# Altium schematic sheet Schematic.SchDoc
size A4
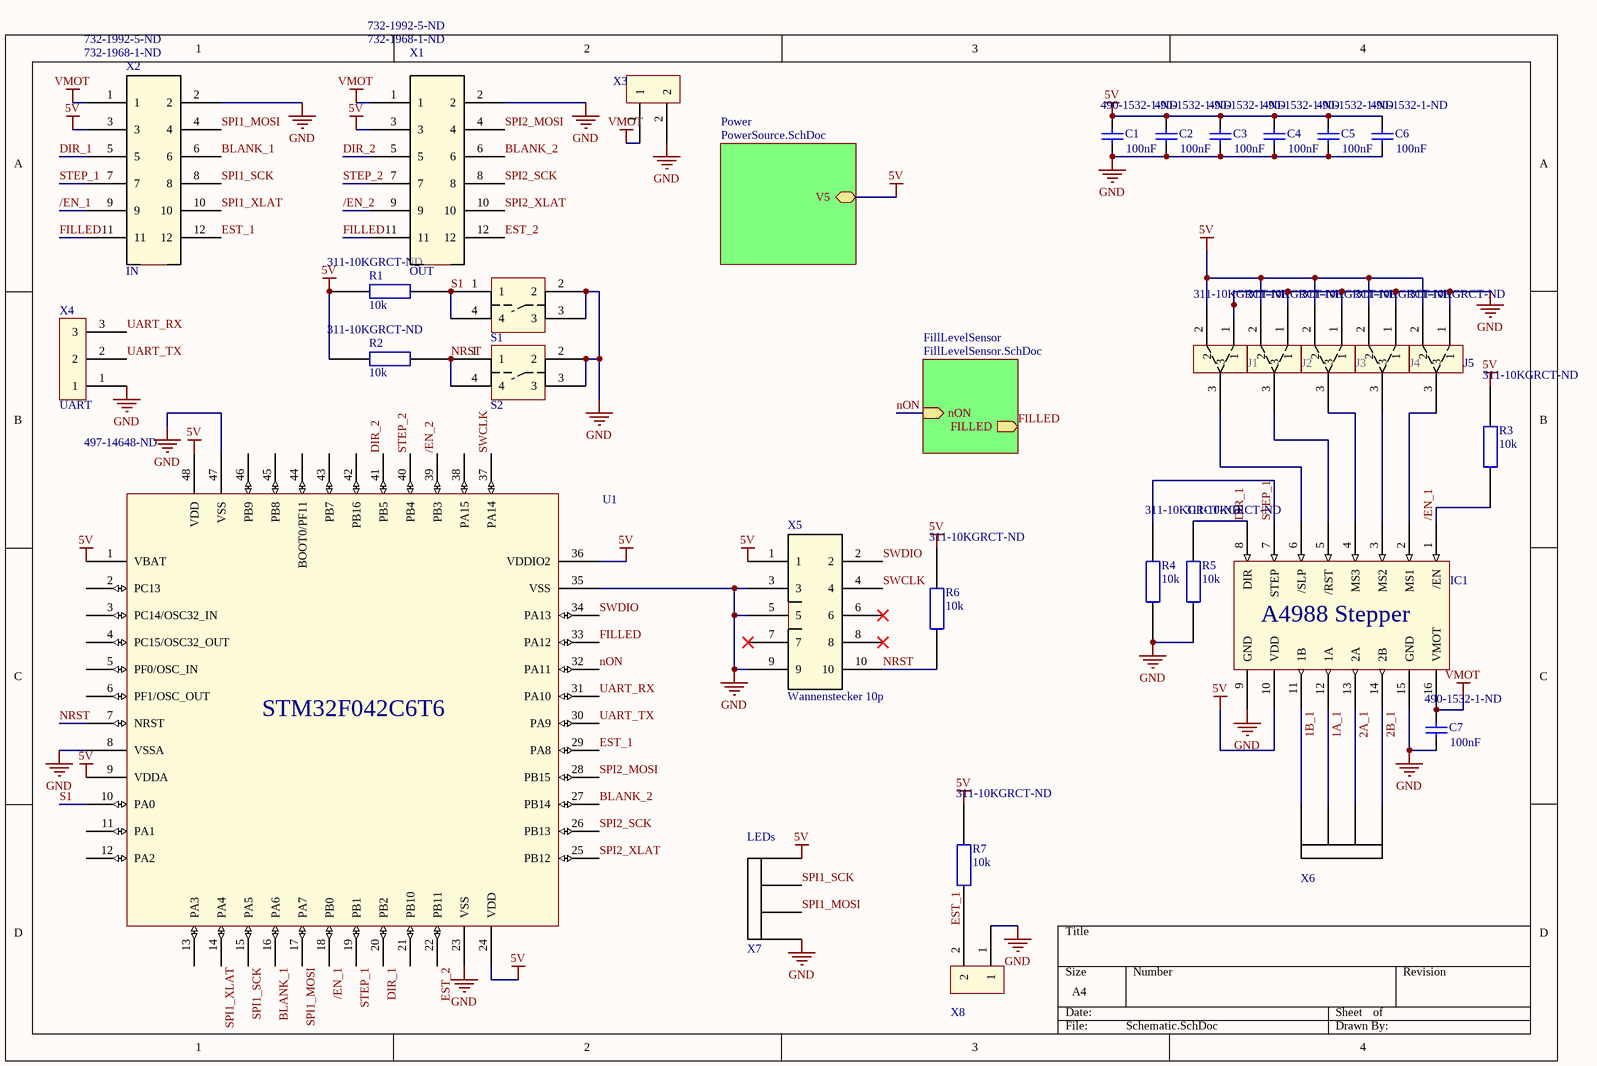
[diagram p0: Schematic.SchDoc]

## Parts
C1  value 100nF  Supplier Part Number 1: 490-1532-1-ND  [Res 0603]  (hidden comment: Cap)
C2  value 100nF  Supplier Part Number 1: 490-1532-1-ND  [Res 0603]  (hidden comment: Cap)
C3  value 100nF  Supplier Part Number 1: 490-1532-1-ND  [Res 0603]  (hidden comment: Cap)
C4  value 100nF  Supplier Part Number 1: 490-1532-1-ND  [Res 0603]  (hidden comment: Cap)
C5  value 100nF  Supplier Part Number 1: 490-1532-1-ND  [Res 0603]  (hidden comment: Cap)
C6  value 100nF  Supplier Part Number 1: 490-1532-1-ND  [Res 0603]  (hidden comment: Cap)
C7  value 100nF  Supplier Part Number 1: 490-1532-1-ND  [Res 0603]  (hidden comment: Cap)
IC1  A4988 Stepper  [A4988 Stepper]  (value not drawn)
J1  Supplier Part Number 1: 311-10KGRCT-ND  [VCC to GND Jumper]  (hidden comment: VCC to GND Jumper)
J2  Supplier Part Number 1: 311-10KGRCT-ND  [VCC to GND Jumper]  (hidden comment: VCC to GND Jumper)
J3  Supplier Part Number 1: 311-10KGRCT-ND  [VCC to GND Jumper]  (hidden comment: VCC to GND Jumper)
J4  Supplier Part Number 1: 311-10KGRCT-ND  [VCC to GND Jumper]  (hidden comment: VCC to GND Jumper)
J5  Supplier Part Number 1: 311-10KGRCT-ND  [VCC to GND Jumper]  (hidden comment: VCC to GND Jumper)
R1  10k  Supplier Part Number 1: 311-10KGRCT-ND  [Res 0603]
R2  10k  Supplier Part Number 1: 311-10KGRCT-ND  [Res 0603]
R3  10k  Supplier Part Number 1: 311-10KGRCT-ND  [Res 0603]
R4  10k  Supplier Part Number 1: 311-10KGRCT-ND  [Res 0603]
R5  10k  Supplier Part Number 1: 311-10KGRCT-ND  [Res 0603]
R6  10k  Supplier Part Number 1: 311-10KGRCT-ND  [Res 0603]
R7  10k  Supplier Part Number 1: 311-10KGRCT-ND  [Res 0603]
S1  Taster  [Taster]  (value not drawn)
S2  Taster  [Taster]  (value not drawn)
U1  Supplier Part Number 1: 497-14648-ND  [LQFP48]  (hidden comment: STM32F042C6T6)
X1  OUT  Supplier Part Number 1: 732-1968-1-ND  Supplier Part Number 2: 732-1992-5-ND  [12p Wurth 690 367 28 12 76]
X2  IN  Supplier Part Number 1: 732-1968-1-ND  Supplier Part Number 2: 732-1992-5-ND  [12p Wurth 690 367 28 12 76]
X3  2p Connector  [2p 2.54 pitch]  (value not drawn)
X4  UART  [3p 2.54 pitch]
X5  Wannenstecker 10p  [Wannenstecker 10p]
X6  4p Connector  [4p 2.54 pitch Motor Connector]  (value not drawn)
X7  LEDs  [4p 2.54 pitch]
X8  2p Connector  [2p 2.54 pitch]  (value not drawn)

## Sub-sheets
FillLevelSensor = FillLevelSensor.SchDoc: nON (in), FILLED (out)
Power = PowerSource.SchDoc: V5

## Nets
5V: C1.2 C2.2 C3.2 C4.2 C5.2 C6.2 IC1.10(VDD) J1.2 J2.2 J3.2 J4.2 J5.2 R1.2 R2.2 R3.2 R6.2 R7.2 U1.1(VBAT) U1.9(VDDA) U1.24(VDD) U1.36(VDDIO2) U1.48(VDD) X1.3 X2.3 X5.1 X7.4 ; sheet Power/V5
GND: C1.1 C2.1 C3.1 C4.1 C5.1 C6.1 C7.1 IC1.9(GND) IC1.15(GND) J1.1 J2.1 J3.1 J4.1 J5.1 R4.1 R5.1 S1.2 S1.3 S2.2 S2.3 U1.8(VSSA) U1.23(VSS) U1.35(VSS) U1.47(VSS) X1.2 X2.2 X3.2 X4.1 X5.3 X5.5 X5.9 X7.1 X8.1
VMOT: C7.2 IC1.16(VMOT) X1.1 X2.1 X3.1
1A_1: IC1.12(1A) X6.3
1B_1: IC1.11(1B) X6.4
2A_1: IC1.13(2A) X6.2
2B_1: IC1.14(2B) X6.1
/EN_1: IC1.1(/EN) R3.1 U1.18(PB0) X2.9
/EN_2: U1.39(PB3) X1.9
BLANK_1: U1.16(PA6) X2.6
BLANK_2: U1.27(PB14) X1.6
DIR_1: IC1.8(DIR) R5.2 U1.20(PB2) X2.5
DIR_2: U1.41(PB5) X1.5
EST_1: R7.1 U1.29(PA8) X2.12 X8.2
EST_2: U1.22(PB11) X1.12
FILLED: U1.33(PA12) X1.11 X2.11 ; sheet FillLevelSensor/FILLED
nON: U1.32(PA11) ; sheet FillLevelSensor/nON
NRST: R2.1 R6.1 S2.1 S2.4 U1.7(NRST) X5.10
S1: R1.1 S1.1 S1.4 U1.10(PA0)
SPI1_MOSI: U1.17(PA7) X2.4 X7.2
SPI1_SCK: U1.15(PA5) X2.8 X7.3
SPI1_XLAT: U1.14(PA4) X2.10
SPI2_MOSI: U1.28(PB15) X1.4
SPI2_SCK: U1.26(PB13) X1.8
SPI2_XLAT: U1.25(PB12) X1.10
STEP_1: IC1.7(STEP) R4.2 U1.19(PB1) X2.7
STEP_2: U1.40(PB4) X1.7
SWCLK: U1.37(PA14) X5.4
SWDIO: U1.34(PA13) X5.2
UART_RX: U1.31(PA10) X4.3
UART_TX: U1.30(PA9) X4.2
NetIC1_2: IC1.2(MS1) J5.3
NetIC1_3: IC1.3(MS2) J4.3
NetIC1_4: IC1.4(MS3) J3.3
NetIC1_5: IC1.5(/RST) J2.3
NetIC1_6: IC1.6(/SLP) J1.3

Not connected (* = marked no-connect by the designer): U1 2(PC13) 3(PC14/OSC32_IN) 4(PC15/OSC32_OUT) 5(PF0/OSC_IN) 6(PF1/OSC_OUT) 11(PA1) 12(PA2) 13(PA3) 21(PB10) 38(PA15) 42(PB16) 43(PB7) 44(BOOT0/PF11) 45(PB8) 46(PB9); X5 6* 7* 8*

## Library data of the parts
C1-C7 = Cap: Capacitor; Published: 8-Jun-2000; LatestRevisionDate: 17-Jul-2002; LatestRevisionNote: Re-released for DXP Platform.; PackageReference: RAD-0.3; Publisher: Altium Limited; PackageDescription: Radial Cap, Thru-Hole; 2 Leads; 0.3 in Pin Spacing; Supplier 1: Digi-Key
R1-R7 = Res: Value: 10k; Supplier 1: Digi-Key
X1 X2 = 12p Connector: Supplier 1: Digi-Key; Supplier 2: Digi-Key
X4 = 3p Connector
X7 = 4p Connector
J1-J5 = VCC to GND Jumper: Supplier 1: Digi-Key
U1 = STM32F042C6T6: Supplier 1: Digi-Key